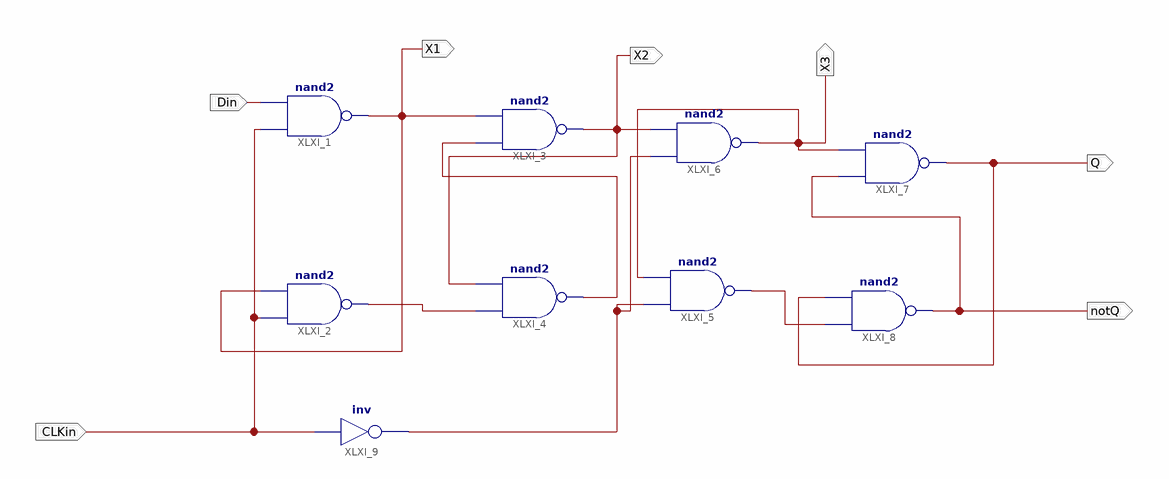
[diagram p0: schematic sheet 1]
// Xilinx ISE schematic dff02e.sch (spartan3e) as structural Verilog: 9 symbols, 7 ports
module dff02e (
  input  Din,
  input  CLKin,
  output notQ,
  output Q,
  output X3,
  output X1,
  output X2
);

  wire XLXN_7, XLXN_8, XLXN_10, XLXN_21;

  nand XLXI_1 (X1, CLKin, Din);
  nand XLXI_2 (XLXN_7, CLKin, X1);
  nand XLXI_4 (XLXN_8, XLXN_7, X2);
  nand XLXI_5 (XLXN_10, XLXN_21, X3);
  nand XLXI_6 (X3, XLXN_21, X2);
  nand XLXI_7 (Q, notQ, X3);
  nand XLXI_8 (notQ, XLXN_10, Q);
  nand XLXI_3 (X2, XLXN_8, X1);
  not XLXI_9 (XLXN_21, CLKin);
endmodule
